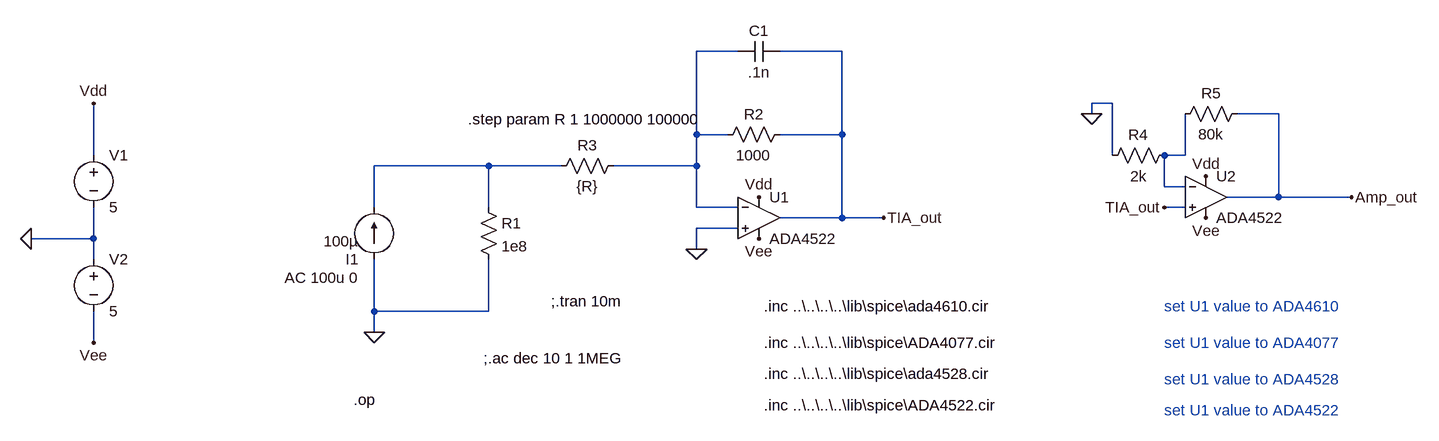
[diagram p0: schematic TIA_example.asc]
TIA_example.asc, the LTspice schematic file:
Version 4
SHEET 1 1288 680
WIRE 224 -272 160 -272
WIRE 384 -272 288 -272
WIRE 800 -192 768 -192
WIRE 768 -176 768 -192
WIRE 1056 -176 992 -176
WIRE 160 -144 160 -272
WIRE 208 -144 160 -144
WIRE 384 -144 384 -272
WIRE 384 -144 288 -144
WIRE -768 -112 -768 -192
WIRE 800 -112 800 -192
WIRE 912 -112 912 -176
WIRE 912 -112 880 -112
WIRE -160 -96 -336 -96
WIRE -48 -96 -160 -96
WIRE 160 -96 160 -144
WIRE 160 -96 32 -96
WIRE 880 -64 880 -112
WIRE 912 -64 880 -64
WIRE 1056 -48 1056 -176
WIRE 1056 -48 976 -48
WIRE 1168 -48 1056 -48
WIRE -336 -32 -336 -96
WIRE -160 -32 -160 -96
WIRE 160 -32 160 -96
WIRE 224 -32 160 -32
WIRE 912 -32 880 -32
WIRE 384 -16 384 -144
WIRE 384 -16 288 -16
WIRE 448 -16 384 -16
WIRE 224 0 160 0
WIRE -768 16 -768 -32
WIRE -768 16 -864 16
WIRE 160 32 160 0
WIRE -768 48 -768 16
WIRE -336 128 -336 48
WIRE -160 128 -160 48
WIRE -160 128 -336 128
WIRE -336 160 -336 128
WIRE -768 176 -768 128
FLAG 160 32 0
FLAG 448 -16 TIA_out
FLAG -864 16 0
FLAG -768 -192 Vdd
FLAG 256 -48 Vdd
FLAG -768 176 Vee
FLAG 256 16 Vee
FLAG -336 160 0
FLAG 768 -176 0
FLAG 944 -80 Vdd
FLAG 944 -16 Vee
FLAG 880 -32 TIA_out
FLAG 1168 -48 Amp_out
SYMBOL res -176 -48 R0
SYMATTR InstName R1
SYMATTR Value 1e8
SYMATTR SpiceLine tol=1 pwr=0.1
SYMBOL current -336 48 R180
WINDOW 3 24 28 Left 2
WINDOW 39 24 84 Left 2
WINDOW 123 24 -28 Left 2
SYMATTR Value 100µ
SYMATTR Value2 AC 100u 0
SYMATTR InstName I1
SYMBOL res 304 -160 R90
WINDOW 0 0 56 VBottom 2
WINDOW 3 32 56 VTop 2
SYMATTR InstName R2
SYMATTR Value 1000
SYMBOL res 48 -112 R90
WINDOW 0 0 56 VBottom 2
WINDOW 3 32 56 VTop 2
SYMATTR InstName R3
SYMATTR Value {R}
SYMBOL Opamps\\opamp2 256 -80 R0
SYMATTR InstName U1
SYMATTR Value ADA4522
SYMBOL voltage -768 -128 R0
WINDOW 123 0 0 Left 2
WINDOW 39 0 0 Left 2
SYMATTR InstName V1
SYMATTR Value 5
SYMBOL voltage -768 32 R0
WINDOW 123 0 0 Left 2
WINDOW 39 0 0 Left 2
SYMATTR InstName V2
SYMATTR Value 5
SYMBOL cap 288 -288 R90
WINDOW 0 0 32 VBottom 2
WINDOW 3 32 32 VTop 2
SYMATTR InstName C1
SYMATTR Value .1n
SYMBOL Opamps\\opamp2 944 -112 R0
SYMATTR InstName U2
SYMATTR Value ADA4522
SYMBOL res 896 -128 R90
WINDOW 0 0 56 VBottom 2
WINDOW 3 32 56 VTop 2
SYMATTR InstName R4
SYMATTR Value 2k
SYMBOL res 1008 -192 R90
WINDOW 0 0 56 VBottom 2
WINDOW 3 32 56 VTop 2
SYMATTR InstName R5
SYMATTR Value 80k
TEXT -368 264 Left 2 !.op
TEXT 264 120 Left 2 !.inc ..\\..\\..\\..\\lib\\spice\\ada4610.cir
TEXT -192 -168 Left 2 !.step param R 1 1000000 100000
TEXT -168 200 Left 2 !;.ac dec 10 1 1MEG
TEXT 264 176 Left 2 !.inc ..\\..\\..\\..\\lib\\spice\\ADA4077.cir
TEXT 880 120 Left 2 ;set U1 value to ADA4610
TEXT 880 176 Left 2 ;set U1 value to ADA4077
TEXT 264 224 Left 2 !.inc ..\\..\\..\\..\\lib\\spice\\ada4528.cir
TEXT 880 232 Left 2 ;set U1 value to ADA4528
TEXT -64 112 Left 2 !;.tran 10m
TEXT 264 272 Left 2 !.inc ..\\..\\..\\..\\lib\\spice\\ADA4522.cir
TEXT 880 280 Left 2 ;set U1 value to ADA4522

The netlist it stands for:
* TIA_example.asc
R1 N003 0 1e8 tol=1 pwr=0.1
I1 0 N003 100µ AC 100u 0
R2 TIA_out N001 1000
R3 N001 N003 {R}
XU1 0 N001 Vdd Vee TIA_out ADA4522  ; pins In+ In- V+ V- OUT
V1 Vdd 0 5
V2 0 Vee 5
C1 TIA_out N001 .1n
XU2 TIA_out N002 Vdd Vee Amp_out ADA4522  ; pins In+ In- V+ V- OUT
R4 N002 0 2k
R5 Amp_out N002 80k
.op
.inc ..\..\..\..\lib\spice\ada4610.cir
.step param R 1 1000000 100000
;.ac dec 10 1 1MEG
.inc ..\..\..\..\lib\spice\ADA4077.cir
* set U1 value to ADA4610
* set U1 value to ADA4077
.inc ..\..\..\..\lib\spice\ada4528.cir
* set U1 value to ADA4528
;.tran 10m
.inc ..\..\..\..\lib\spice\ADA4522.cir
* set U1 value to ADA4522
.backanno
.end